# EAGLE schematic Temp controlled fan (2) (EAGLE 8.4.1)
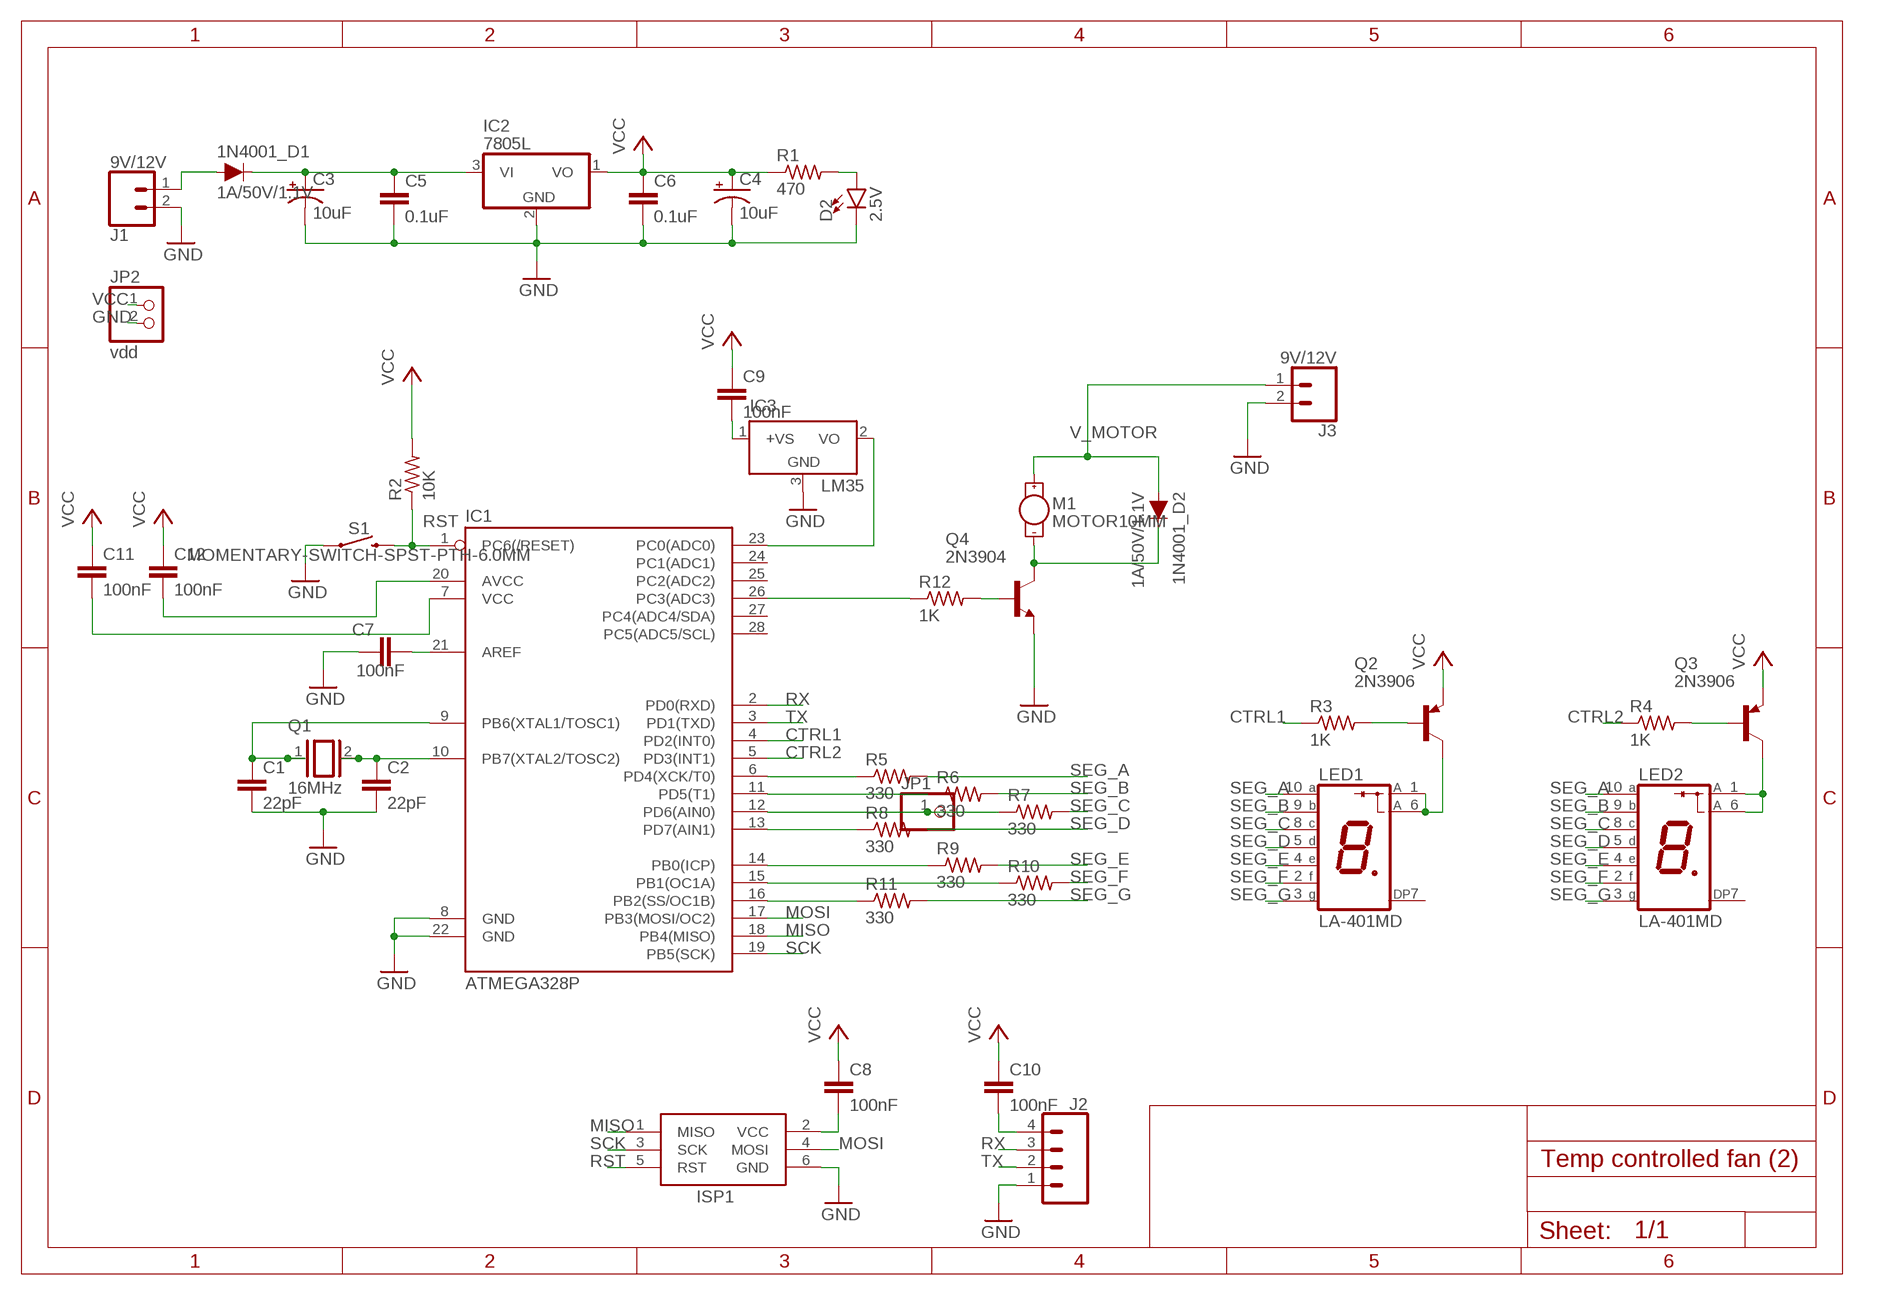
[diagram p0: schematic, sheet 1]

## Parts
1N4001_D1  1A/50V/1.1V  DIODE-PTH  [DIODE-1N4001]
1N4001_D2  1A/50V/1.1V  DIODE-PTH  [DIODE-1N4001]
C1  22pF  22PF-0603-50V-5%  [0603]
C2  22pF  22PF-0603-50V-5%  [0603]
C3  10uF  10UF-POLAR-RADIAL-2.5MM-25V-20%  [CPOL-RADIAL-2.5MM-5MM]
C4  10uF  10UF-POLAR-RADIAL-2.5MM-25V-20%  [CPOL-RADIAL-2.5MM-5MM]
C5  0.1uF  0.1UF-0603-25V-5%  [0603]
C6  0.1uF  0.1UF-0603-25V-5%  [0603]
C7  100nF  22PF-0603-50V-5%  [0603]
C8  100nF  22PF-0603-50V-5%  [0603]
C9  100nF  22PF-0603-50V-5%  [0603]
C10  100nF  22PF-0603-50V-5%  [0603]
C11  100nF  22PF-0603-50V-5%  [0603]
C12  100nF  22PF-0603-50V-5%  [0603]
D2  2.5V  LED1206  [LED-1206]
IC1  ATMEGA328P  ATMEGA328P_PDIP  [DIP28]
IC2  7805L  [TO92]
IC3  LM35  LM35CZ  [TO92]
ISP1  AVRISP-6  [AVRISP]
J1  9V/12V  CONN_02PTH_RA_FEMALE  [1X02_RA_PTH_FEMALE]
J2  CONN_04  [1X04]
J3  9V/12V  CONN_02PTH_RA_FEMALE  [1X02_RA_PTH_FEMALE]
JP1  PINHD-1X1  [1X01]
JP2  vdd  PINHD-1X2  [1X02]
LED1  LA-401MD  [LA-401]
LED2  LA-401MD  [LA-401]
M1  MOTOR10MM  [VIBE-MOTOR-10MM]
Q1  16MHz  XTAL/S  [QS]
Q2  2N3906  [TO92]
Q3  2N3906  [TO92]
Q4  2N3904  [TO92]
R1  470  R-US_R0805  [R0805]
R2  10K  R-US_R0805  [R0805]
R3  1K  R-US_R0805  [R0805]
R4  1K  R-US_R0805  [R0805]
R5  330  R-US_R0805  [R0805]
R6  330  R-US_R0805  [R0805]
R7  330  R-US_R0805  [R0805]
R8  330  R-US_R0805  [R0805]
R9  330  R-US_R0805  [R0805]
R10  330  R-US_R0805  [R0805]
R11  330  R-US_R0805  [R0805]
R12  1K  R-US_R0805  [R0805]
S1  MOMENTARY-SWITCH-SPST-PTH-6.0MM  [TACTILE_SWITCH_PTH_6.0MM]

## Nets
CTRL1: IC1.4(PD2(INT0)) R3.1
CTRL2: IC1.5(PD3(INT1)) R4.1
GND: C1.2 C2.2 C3.2(-) C4.2(-) C5.2 C6.2 C7.1 D2.C IC1.8(GND) IC1.22(GND) IC2.2(GND) IC3.3(GND) ISP1.6(GND) J1.2 J2.1 J3.2 JP2.2 Q4.3(E) S1.1
MISO: IC1.18(PB4(MISO)) ISP1.1(MISO)
MOSI: IC1.17(PB3(MOSI/OC2)) ISP1.4(MOSI)
N$1: C2.1 IC1.10(PB7(XTAL2/TOSC2)) Q1.2
N$2: C7.2 IC1.21(AREF)
N$3: C1.1 IC1.9(PB6(XTAL1/TOSC1)) Q1.1
N$4: IC1.23(PC0(ADC0)) IC3.2(VO)
N$5: D2.A R1.2
N$6: C12.2 IC1.20(AVCC)
N$7: 1N4001_D1.C C3.1(+) C5.1 IC2.3(VI)
N$8: C11.2 IC1.7(VCC)
N$9: LED2.1(A) LED2.6(A) Q3.1(C)
N$10: C10.2 J2.4
N$11: LED1.1(A) LED1.6(A) Q2.1(C)
N$12: Q3.2(B) R4.2
N$13: Q2.2(B) R3.2
N$14: Q4.2(B) R12.2
N$15: 1N4001_D2.C M1.- Q4.1(C)
N$16: IC1.26(PC3(ADC3)) R12.1
N$17: C9.2 IC3.1(+VS)
N$18: IC1.16(PB2(SS/OC1B)) R11.1
N$19: IC1.15(PB1(OC1A)) R10.1
N$20: IC1.14(PB0(ICP)) R9.1
N$21: IC1.13(PD7(AIN1)) R8.1
N$22: IC1.12(PD6(AIN0)) JP1.1 R7.1
N$23: IC1.11(PD5(T1)) R6.1
N$24: IC1.6(PD4(XCK/T0)) R5.1
N$25: C8.2 ISP1.2(VCC)
RST: IC1.1(PC6(/RESET)) ISP1.5(RST) R2.1 S1.3
RX: IC1.2(PD0(RXD)) J2.3
SCK: IC1.19(PB5(SCK)) ISP1.3(SCK)
SEG_A: LED1.10(A) LED2.10(A) R5.2
SEG_B: LED1.9(B) LED2.9(B) R6.2
SEG_C: LED1.8(C) LED2.8(C) R7.2
SEG_D: LED1.5(D) LED2.5(D) R8.2
SEG_E: LED1.4(E) LED2.4(E) R9.2
SEG_F: LED1.2(F) LED2.2(F) R10.2
SEG_G: LED1.3(G) LED2.3(G) R11.2
TX: IC1.3(PD1(TXD)) J2.2
V_IN: 1N4001_D1.A J1.1
V_MOTOR: 1N4001_D2.A J3.1 M1.+
VCC: C4.1(+) C6.1 C8.1 C9.1 C10.1 C11.1 C12.1 IC2.1(VO) JP2.1 Q2.3(E) Q3.3(E) R1.1 R2.2
Unconnected: IC1.24(PC1(ADC1)) IC1.25(PC2(ADC2)) IC1.27(PC4(ADC4/SDA)) IC1.28(PC5(ADC5/SCL)) LED1.7(DP) LED2.7(DP)

## Library data of the parts
1N4001_D1 1N4001_D2 = SparkFun-DiscreteSemi:DIODE: Diode These are standard reverse protection diodes and small signal diodes. SparkFun Products: SparkFun SparkPunk Sound Kit <https://www.sparkfun.com/products/11177> SparkFun ESP8266 Thing <https://www.sparkfun.com/products/13231>; PROD_ID: DIO-09176
C1 C2 = SparkFun-Capacitors:22PF: 22pF ceramic capacitors A capacitor is a passive two-terminal electrical component used to store electrical energy temporarily in an electric field.; PROD_ID: CAP-07876
C3 C4 = SparkFun-Capacitors:10UF-POLAR: 10.0µF polarized capacitors A capacitor is a passive two-terminal electrical component used to store electrical energy temporarily in an electric field.; PROD_ID: CAP-08440
C5 C6 = SparkFun-Capacitors:0.1UF: 0.1µF ceramic capacitors A capacitor is a passive two-terminal electrical component used to store electrical energy temporarily in an electric field.; PROD_ID: CAP-08604
C7-C12 = SparkFun-Capacitors:22PF: 22pF ceramic capacitors A capacitor is a passive two-terminal electrical component used to store electrical energy temporarily in an electric field.; PROD_ID: CAP-07876; VALUE: 22pF
D2 = SparkFun-LED:LED: LED (Generic) Standard schematic elements and footprints for 5mm, 3mm, 1206, and 0603 sized LEDs. Generic LEDs with no color specified.
IC1 = SparkFun-IC-Microcontroller:ATMEGA328P_PDIP: Atmel 328P Through hole ATMEGA328P uC used in the Arduino 32kb flash, 1k EEPROM, 2k SRAM Datasheet <http://www.sparkfun.com/datasheets/Components/SMD/ATMega328.pdf> SparkFun Products Storefront component: AVR 28 Pin 20MHz 32K 6A/D - ATMega328P <https://www.sparkfun.com/products/9061> (COM-09061) SparkFun Simon Says - Through-Hole Soldering Kit <https://www.sparkfun.com/products/10547> (KIT-10547) SparkFun Learn to Solder - Simon Says <https://www.sparkfun.com/products/13708> (KIT-13708) SparkFun BigTime Watch Kit <https://www.sparkfun.com/products/11734> (KIT-11734) SparkFun ClockIt <https://www.sparkfun.com/products/10930> (KIT-10930) SparkFun Serial Enabled LCD Kit <https://www.sparkfun.com/products/10097> (LCD-10097) SparkFun Simon Tilts - Through Hole Soldering Kit <https://www.sparkfun.com/products/12634> (KIT-12634) SparkFun Frequency Counter Kit <https://www.sparkfun.com/products/10140> (KIT-10140) FabFM Radio Kit <https://www.sparkfun.com/products/11043> (KIT-11043) SparkFun Binary Blaster Kit <https://www.sparkfun.com/products/12037> (KIT-12037) SparkFun Metro-Gnome <https://www.sparkfun.com/products/9236> (KIT-09236) ATmega328 with Arduino Optiboot (Uno) <https://www.sparkfun.com/products/10524> (DEV-10524); PROD_ID: IC-09136; VALUE: 328P
IC2 = adafruit:78*: Positive VOLTAGE REGULATOR Added bigger pads to the TO-92 package
IC3 = lm35:LM35: Single-Supply Centigrade Temperature Sensor Vout = (10mV/°C x Temp °C) +5mmmV Source: http://www.national.com/ds/LM/LM35.pdf
ISP1 = adafruit:AVRISP: AVR ISP HEADER Standard 6 pin header for AVR programming
J1 J3 = SparkFun-Connectors:CONN_02: Multi connection point. Often used as Generic Header-pin footprint for 0.1 inch spaced/style header connections On any of the 0.1 inch spaced packages, you can populate with these: Break Away Headers - Straight <https://www.sparkfun.com/products/116> (PRT-00116) Break Away Male Headers - Right Angle <https://www.sparkfun.com/products/553> (PRT-00553) Female Headers <https://www.sparkfun.com/products/115> (PRT-00115) Break Away Headers - Machine Pin <https://www.sparkfun.com/products/117> (PRT-00117) Break Away Female Headers - Swiss Machine Pin <https://www.sparkfun.com/products/743> (PRT-00743) For SCREWTERMINALS and SPRING TERMINALS visit here: Screw Terimnals on SparkFun.com <https://www.sparkfun.com/search/results?term=Screw+Terminals> (5mm/3.5mm/2.54mm spacing) This device is also useful as a general connection point to wire up your design to another part of your project. Our various solder wires solder well into these plated through hole pads. Hook-Up Wire - Assortment (Stranded, 22 AWG) <https://www.sparkfun.com/products/11375> (PRT-11375) Hook-Up Wire - Assortment (Solid Core, 22 AWG) <https://www.sparkfun.com/products/11367> (PRT-11367) View the entire wire category on our website here <https://www.sparkfun.com/categories/141> Special notes: Molex polarized connector foot print use with: PRT-08233 with associated crimp pins and housings. 2.54_SCREWTERM for use with PRT-10571. 3.5mm Screw Terminal footprints for PRT-08084 5mm Screw Terminal footprints for use with PRT-08432; PROD_ID: CONN-13700
J2 = SparkFun-Connectors:CONN_04: Multi connection point. Often used as Generic Header-pin footprint for 0.1 inch spaced/style header connections On any of the 0.1 inch spaced packages, you can populate with these: Break Away Headers - Straight <https://www.sparkfun.com/products/116> (PRT-00116) Break Away Male Headers - Right Angle <https://www.sparkfun.com/products/553> (PRT-00553) Female Headers <https://www.sparkfun.com/products/115> (PRT-00115) Break Away Headers - Machine Pin <https://www.sparkfun.com/products/117> (PRT-00117) Break Away Female Headers - Swiss Machine Pin <https://www.sparkfun.com/products/743> (PRT-00743) For SCREWTERMINALS and SPRING TERMINALS visit here: Screw Terimnals on SparkFun.com <https://www.sparkfun.com/search/results?term=Screw+Terminals> (5mm/3.5mm/2.54mm spacing) This device is also useful as a general connection point to wire up your design to another part of your project. Our various solder wires solder well into these plated through hole pads. Hook-Up Wire - Assortment (Stranded, 22 AWG) <https://www.sparkfun.com/products/11375> (PRT-11375) Hook-Up Wire - Assortment (Solid Core, 22 AWG) <https://www.sparkfun.com/products/11367> (PRT-11367) View the entire wire category on our website here <https://www.sparkfun.com/categories/141> Special notes: Molex polarized connector foot print use with SKU : PRT-08231 with associated crimp pins and housings. 1MM SMD Version SKU: PRT-10208; PROD_ID: CONN-09696
JP1 = adafruit:PINHD-1X1: Pin header 1x1 for 0.1" spacing With round pins
JP2 = pinhead:PINHD-1X2: PIN HEADER
LED1 LED2 = led-7-segment:LA-401*D: Single Digit LED Numeric Display (anode common) Source: ROHM .. la-1401dn.pdf; OC_FARNELL: unknown; OC_NEWARK: unknown
M1 = SparkFun-Electromechanical:MOTOR: Motor (Single-Phase) Two-terminal, single-phase motors. SparkFun Products Vibration Motor <https://www.sparkfun.com/products/8449> (ROB-08449) Physical dimension and wire connections for this powerful vibration motor. Motor has a self adhesive backing.; PROD_ID: COMP-08572; SF_SKU: ROB-08449
Q1 = special:XTAL/S: CRYSTAL
Q2 Q3 = transistor-pnp:2N3906: PNP Transistor
Q4 = transistor-npn:2N3904: NPN Transistor
R1-R12 = adafruit:R-US_: RESISTOR, American symbol
S1 = SparkFun-Switches:MOMENTARY-SWITCH-SPST: Momentary Switch (Pushbutton) - SPST Normally-open (NO) SPST momentary switches (buttons, pushbuttons). Variants PTH-12MM - 12mm square, through-hole Momentary Pushbutton Switch - 12mm Square <https://www.sparkfun.com/products/9190> (COM-09190) PTH-6.0MM, PTH-6.0MM-KIT - 6.0mm square, through-hole Mini Pushbutton Switch <https://www.sparkfun.com/products/97> (COM-00097) KIT package intended for soldering kit's - only one side of pads' copper is exposed. PTH-RIGHT-ANGLE-KIT - Right-angle, through-hole Right Angle Tactile Button <https://www.sparkfun.com/products/10791> - Used on SparkFun BigTime Watch Kit <https://www.sparkfun.com/products/11734> SMD-12MM - 12mm square, surface-mount Tactile Button - SMD (12mm) <https://www.sparkfun.com/products/12993> (COM-12993) Used on SparkFun PicoBoard <https://www.sparkfun.com/products/11888> SMD-4.5MM - 4.5mm Square Trackball Switch Used on SparkFun Blackberry Trackballer Breakout <https://www.sparkfun.com/products/13169> SMD-4.6MMX2.8MM - 4.60mm x 2.80mm, surface mount Used on SparkFun SAMD21 Mini Breakout <https://www.sparkfun.com/products/13664> SMD-5.2MM, SMD-5.2-REDUNDANT - 5.2mm square, surface-mount Mini Pushbutton Switch - SMD <https://www.sparkfun.com/products/8720> (COM-08720) Used on Arduino Pro Mini <https://www.sparkfun.com/products/11114> REDUNDANT package connects both switch circuits together SMD-6.0X3.5MM - 6.0 x 3.5mm, surface mount Momentary Reset Switch SMD <https://www.sparkfun.com/products/8229> (COM-08229) SMD-6.2MM-TALL - 6.2mm square, surface mount Tactile Button - SMD (6mm) <https://www.sparkfun.com/products/12992> Used on SparkFun Digital Sandbox <https://www.sparkfun.com/products/12651> SMD-RIGHT-ANGLE - Right-angle, surface mount Used on SparkFun Block for Intel® Edison - Arduino <https://www.sparkfun.com/products/13036>; PROD_ID: SWCH-08441; SF_SKU: COM-00097